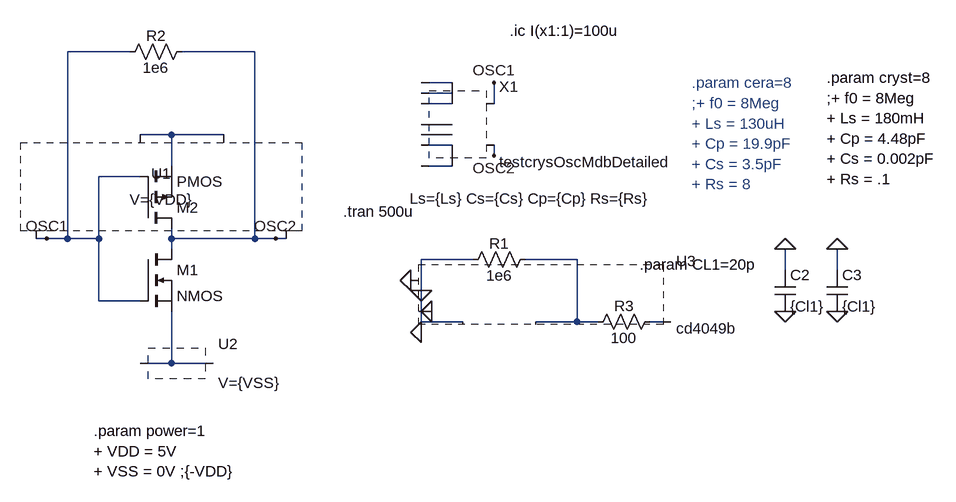
[diagram p0: schematic crystalVsCeramics.asc]
crystalVsCeramics.asc, the LTspice schematic file:
Version 4
SHEET 1 880 680
WIRE -640 -48 -736 -48
WIRE -448 -48 -560 -48
WIRE -144 0 -192 0
WIRE -144 16 -192 16
WIRE -144 32 -192 32
WIRE -80 32 -80 0
WIRE -144 64 -192 64
WIRE -576 80 -624 80
WIRE -496 80 -576 80
WIRE -144 80 -192 80
WIRE -144 96 -192 96
WIRE -80 112 -80 96
WIRE -576 128 -576 80
WIRE -144 128 -192 128
WIRE -624 144 -688 144
WIRE -768 240 -784 240
WIRE -736 240 -736 -48
WIRE -736 240 -768 240
WIRE -688 240 -688 144
WIRE -688 240 -736 240
WIRE -576 240 -576 224
WIRE -448 240 -448 -48
WIRE -448 240 -576 240
WIRE -416 240 -448 240
WIRE -400 240 -416 240
WIRE -576 256 -576 240
WIRE -112 272 -192 272
WIRE 48 272 -32 272
WIRE 368 288 368 256
WIRE 448 288 448 256
WIRE -192 320 -192 272
WIRE -688 336 -688 240
WIRE -624 336 -688 336
WIRE -192 368 -192 320
WIRE -128 368 -192 368
WIRE 48 368 48 272
WIRE 48 368 -16 368
WIRE 80 368 48 368
WIRE 192 368 160 368
WIRE -576 432 -576 352
WIRE -576 432 -624 432
WIRE -512 432 -576 432
FLAG 368 352 0
FLAG 448 352 0
FLAG -80 0 OSC1
FLAG -80 112 OSC2
FLAG 368 256 0
FLAG 448 256 0
FLAG -416 240 OSC2
FLAG -768 240 OSC1
FLAG -176 352 0
FLAG -192 384 0
FLAG -208 304 0
FLAG -192 320 0
DATAFLAG -192 64 "$"
DATAFLAG -192 80 "$"
DATAFLAG -192 96 "$"
DATAFLAG -192 128 "$"
DATAFLAG -192 0 "round(10k*$)/10k"
DATAFLAG -192 16 "round(10k*$)/10k"
DATAFLAG -192 32 "round(10k*$)/10k"
SYMBOL testcrysOscMdbDetailed -80 64 R0
WINDOW 39 -130 114 Left 2
SYMATTR InstName X1
SYMATTR SpiceLine Ls={Ls} Cs={Cs} Cp={Cp} Rs={Rs}
SYMBOL cap 352 288 R0
SYMATTR InstName C2
SYMATTR Value {Cl1}
SYMBOL cap 432 288 R0
SYMATTR InstName C3
SYMATTR Value {Cl1}
SYMBOL EIT_Semiconductors\\nmos -624 256 R0
SYMATTR InstName M1
SYMBOL EIT_Semiconductors\\pmos -624 224 M180
SYMATTR InstName M2
SYMBOL MDB_sym\\source-Vmarker -624 80 R0
SYMATTR InstName U1
SYMATTR Value V={VDD}
SYMBOL MDB_sym\\source-Vmarker -624 432 R0
SYMATTR InstName U2
SYMATTR Value V={VSS}
SYMBOL res -656 -32 R270
WINDOW 0 25 56 VTop 2
WINDOW 3 7 56 VBottom 2
SYMATTR InstName R2
SYMATTR Value 1e6
SYMBOL res -128 288 R270
WINDOW 0 25 56 VTop 2
WINDOW 3 7 56 VBottom 2
SYMATTR InstName R1
SYMATTR Value 1e6
SYMBOL Dig_Add\\CD4xxx\\cd4049b -80 304 R0
SYMATTR InstName U3
SYMATTR SpiceLine VDD=5  SPEED=1  TRIPDT=5e-9
SYMBOL res 64 384 R270
WINDOW 0 25 56 VTop 2
WINDOW 3 7 56 VBottom 2
SYMATTR InstName R3
SYMATTR Value 100
TEXT 224 0 Left 2 ;.param cera=8\n;+ f0 = 8Meg\n+ Ls = 130uH\n+ Cp = 19.9pF\n+ Cs = 3.5pF\n+ Rs = 8
TEXT -312 198 Left 2 !.tran 500u
TEXT -56 -80 Left 2 !.ic I(x1:1)=100u
TEXT 144 280 Left 2 !.param CL1=20p
TEXT 432 -8 Left 2 !.param cryst=8\n;+ f0 = 8Meg\n+ Ls = 180mH\n+ Cp = 4.48pF\n+ Cs = 0.002pF\n+ Rs = .1
TEXT -696 536 Left 2 !.param power=1\n+ VDD = 5V\n+ VSS = 0V ;{-VDD}

The netlist it stands for:
* crystalVsCeramics.asc
* X1: testcrysOscMdbDetailed Ls={Ls} Cs={Cs} Cp={Cp} Rs={Rs} (symbol testcrysOscMdbDetailed not available, pin order unknown); nets seen at it: N001, N002, N003, N004, N006, N007, N008, OSC1, OSC2
C2 0 0 {Cl1}
C3 0 0 {Cl1}
M1 OSC2 OSC1 N011 N011 NMOS
M2 OSC2 OSC1 N005 N005 PMOS
* U1: V={VDD} (symbol MDB_sym\source-Vmarker not available, pin order unknown); nets seen at it: N005, OSC1, OSC2
* U2: V={VSS} (symbol MDB_sym\source-Vmarker not available, pin order unknown); nets seen at it: N011
R2 OSC1 OSC2 1e6
R1 0 N009 1e6
* U3: cd4049b VDD=5  SPEED=1  TRIPDT=5e-9 (symbol Dig_Add\CD4xxx\cd4049b not available, pin order unknown); nets seen at it: 0, N009, N010
R3 N009 N010 100
.model NMOS NMOS
.model PMOS PMOS
.lib standard.mos
* .param cera=8
* ;+ f0 = 8Meg
* + Ls = 130uH
* + Cp = 19.9pF
* + Cs = 3.5pF
* + Rs = 8
.tran 500u
.ic I(x1:1)=100u
.param CL1=20p
.param cryst=8
;+ f0 = 8Meg
+ Ls = 180mH
+ Cp = 4.48pF
+ Cs = 0.002pF
+ Rs = .1
.param power=1
+ VDD = 5V
+ VSS = 0V ;{-VDD}
.backanno
.end